# Altium schematic sheet SDEC944-xD_Liaison_IHM.SchDoc: Liaison IHM
size 393 x 270 mm; CompanyName: Seccom; Address1: 521, rue du capt. François Garbit; Address2: 69440 Mornant; Address3: seccom@seccom.fr; Address4: www.seccom.fr; DocumentNumber: 8; SheetNumber: 8; SheetTotal: 22; PageSetup: Record=PageOptions|CenterHorizontal=True|CenterVertical=True|PrintScale=0.74|XCorrection=1.00|YCorrection=1.00|PrintKind=0|BorderSize=5000000|LeftOffset=0|BottomOffset=0|Orientation=2|PaperLength=1000|PaperWidth=1000|Scale=100|PaperSource=7|PrintQuality=-4|MediaType=1|DitherType=10|PaperKind=A4|PrintScaleMode=1
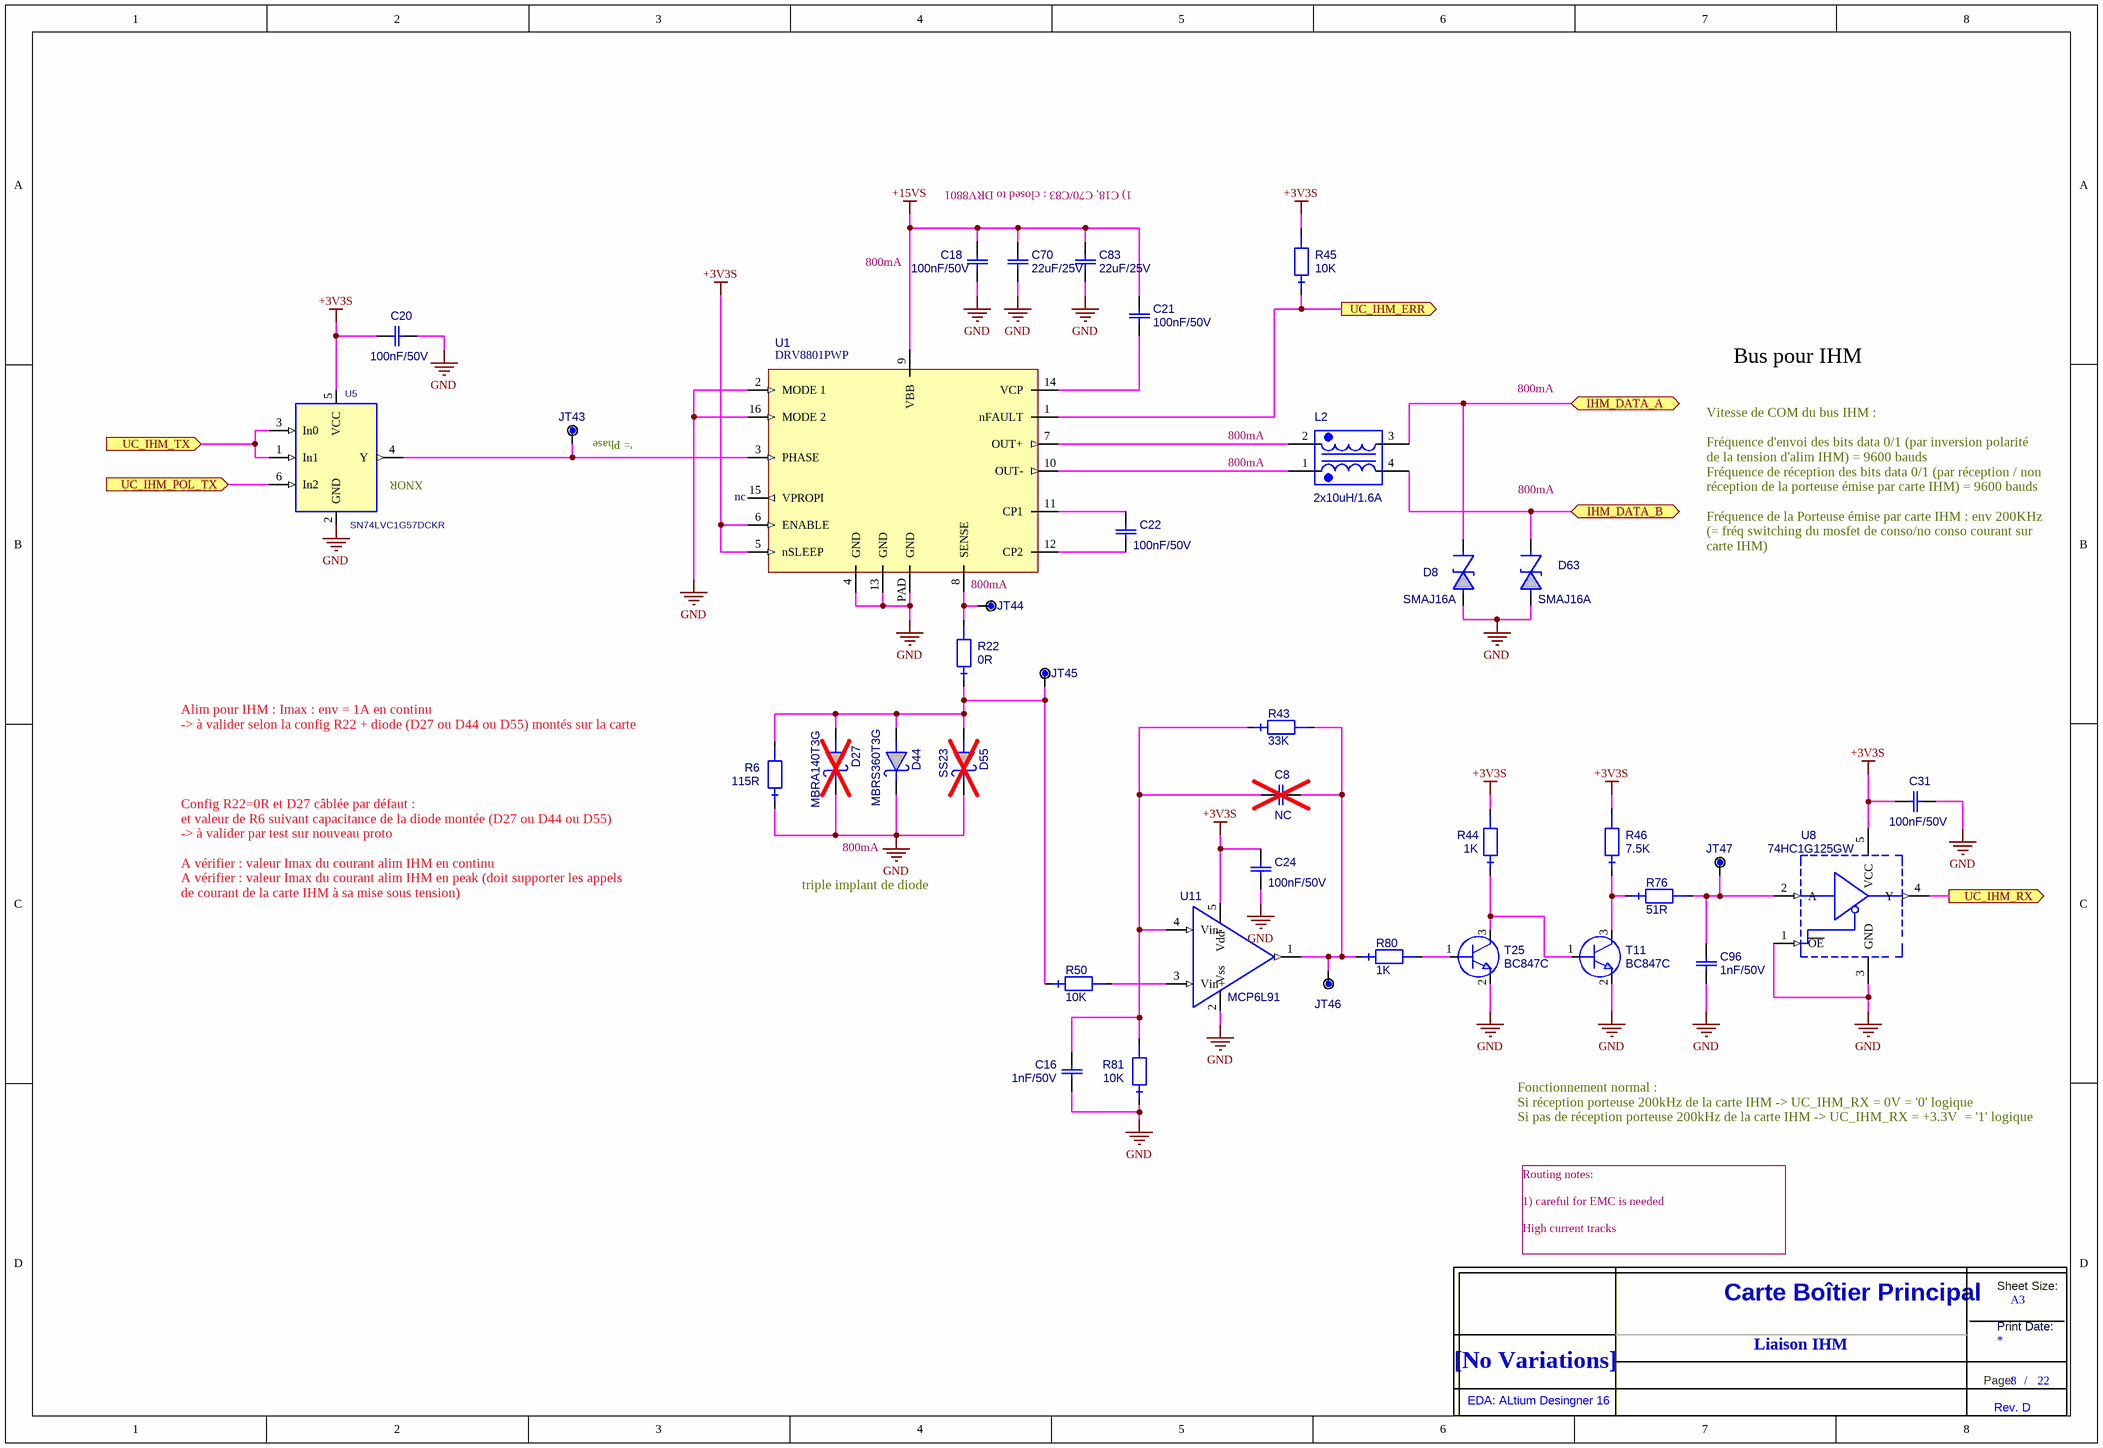
[diagram p0: SDEC944-xD_Liaison_IHM.SchDoc]

## Parts
C8  value NC  [0603_ReflowSoldering_CAP]  (hidden comment: C_0603_NC)  (no BOM)
C16  value 1nF/50V  [0603_ReflowSoldering_CAP]  (hidden comment: C_0603_NPO_5%_1N-50V)
C18  value 100nF/50V  [0603_ReflowSoldering_CAP]  (hidden comment: C_0603_X7R_10%_100N-50V)
C20  value 100nF/50V  [0603_ReflowSoldering_CAP]  (hidden comment: C_0603_X7R_10%_100N-50V)
C21  value 100nF/50V  [0603_ReflowSoldering_CAP]  (hidden comment: C_0603_X7R_10%_100N-50V)
C22  value 100nF/50V  [0603_ReflowSoldering_CAP]  (hidden comment: C_0603_X7R_10%_100N-50V)
C24  value 100nF/50V  [0603_ReflowSoldering_CAP]  (hidden comment: C_0603_X7R_10%_100N-50V)
C31  value 100nF/50V  [0603_ReflowSoldering_CAP]  (hidden comment: C_0603_X7R_10%_100N-50V)
C70  value 22uF/25V  [1206_ReflowSoldering_CAP]  (hidden comment: C_1206_X5R_20%_22U-25V)
C83  value 22uF/25V  [1206_ReflowSoldering_CAP]  (hidden comment: C_1206_X5R_20%_22U-25V)
C96  value 1nF/50V  [0603_ReflowSoldering_CAP]  (hidden comment: C_0603_NPO_5%_1N-50V)
D8  SMAJ16A  [DO214AC-SMA-P_ReflowSoldering]
D27  MBRA140T3G  [DO214AC-SMA-P_ReflowSoldering]  (no BOM)
D44  MBRS360T3G  [DO214AB-SMC-P_ReflowSoldering]
D55  SS23  [DO214AA-SMB-P_ReflowSoldering]  (no BOM)
D63  SMAJ16A  [DO214AC-SMA-P_ReflowSoldering]
JT43  POINT_TEST_PAD_40MIL  [PAD_CL5_E40X40Y17D]  (value not drawn)  (no BOM)
JT44  POINT_TEST_PAD_40MIL  [PAD_CL5_E40X40Y17D]  (value not drawn)  (no BOM)
JT45  POINT_TEST_PAD_40MIL  [PAD_CL5_E40X40Y17D]  (value not drawn)  (no BOM)
JT46  POINT_TEST_PAD_40MIL  [PAD_CL5_E40X40Y17D]  (value not drawn)  (no BOM)
JT47  POINT_TEST_PAD_40MIL  [PAD_CL5_E40X40Y17D]  (value not drawn)  (no BOM)
L2  value 2x10uH/1.6A  [SELF_WE-SL2_9.2x6]  (hidden comment: IND_FERRITE_WE-SL2_2X10UH)
R6  value 115R  [0603_ReflowSoldering_RES]  (hidden comment: RES_0603_1%_100PPM_115R)
R22  value 0R  [0603_ReflowSoldering_RES]  (hidden comment: RES_0603_1%_100PPM_0R)
R43  value 33K  [0603_ReflowSoldering_RES]  (hidden comment: RES_0603_1%_100PPM_33K)
R44  value 1K  [0603_ReflowSoldering_RES]  (hidden comment: RES_0603_1%_100PPM_1K)
R45  value 10K  [0603_ReflowSoldering_RES]  (hidden comment: RES_0603_1%_100PPM_10K)
R46  value 7.5K  [0603_ReflowSoldering_RES]  (hidden comment: RES_0603_1%_100PPM_7.5K)
R50  value 10K  [0603_ReflowSoldering_RES]  (hidden comment: RES_0603_1%_100PPM_10K)
R76  value 51R  [0603_ReflowSoldering_RES]  (hidden comment: RES_0603_1%_100PPM_51R)
R80  value 1K  [0603_ReflowSoldering_RES]  (hidden comment: RES_0603_1%_100PPM_1K)
R81  value 10K  [0603_ReflowSoldering_RES]  (hidden comment: RES_0603_1%_100PPM_10K)
T11  BC847C  [SOT23_3L_ReflowSoldering]
T25  BC847C  [SOT23_3L_ReflowSoldering]
Title_new  DNI  (value not drawn)  (graphical)
U1  DRV8801PWP  [HTSSOP_016_E0,65_L4,4MM_PWP]
U5  value SN74LVC1G57DCKR  [SC70_6]  (hidden comment: 74LVC1G57DCKR)
U8  74HC1G125GW  [SOT353]
U11  value MCP6L91  [SOT23_5L]  (hidden comment: MCP6L91T-E/OT)

## Ports
IHM_DATA_A (bidir), IHM_DATA_B (bidir), UC_IHM_ERR (out), UC_IHM_POL_TX (in), UC_IHM_RX (out), UC_IHM_TX (in)

## Nets
+3V3S: C20.1 C24.1 C31.1 R44.2 R45.2 R46.2 U1.5(nSLEEP) U1.6(ENABLE) U5.5(VCC) U8.5(VCC) U11.5(Vdd)
+15VS: C18.1 C21.1 C70.2 C83.2 U1.9(VBB)
GND: C16.1 C18.2 C20.2 C24.2 C31.2 C70.1 C83.1 C96.1 D8.A D27.K D44.K D55.K D63.A R6.1 R81.1 T11.2(E) T25.2(E) U1.2(MODE_1) U1.4(GND) U1.13(GND) U1.16(MODE_2) U1.PAD(GND) U5.2(GND) U8.1 U8.3(GND) U11.2(Vss)
IHM_DATA_A: D8.K L2.3 ; port IHM_DATA_A
IHM_DATA_B: D63.K L2.4 ; port IHM_DATA_B
UC_IHM_ERR: R45.1 U1.1(nFAULT) ; port UC_IHM_ERR
UC_IHM_POL_TX: U5.6(In2) ; port UC_IHM_POL_TX
UC_IHM_RX: U8.4(Y) ; port UC_IHM_RX
UC_IHM_TX: U5.1(In1) U5.3(In0) ; port UC_IHM_TX
NetC8_1: C8.1 JT46.1 R43.2 R80.1 U11.1(OUTPUT)
NetC8_2: C8.2 C16.2 R43.1 R81.2 U11.4(Vin-)
NetC21_2: C21.2 U1.14(VCP)
NetC22_1: C22.1 U1.11(CP1)
NetC22_2: C22.2 U1.12(CP2)
NetC96_2: C96.2 JT47.1 R76.2 U8.2(A)
NetD27_A: D27.A D44.A D55.A JT45.1 R6.2 R22.1 R50.1
NetJT43_1: JT43.1 U1.3(PHASE) U5.4(Y)
NetJT44_1: JT44.1 R22.2 U1.8(SENSE)
NetL2_1: L2.1 U1.10(OUT-)
NetL2_2: L2.2 U1.7(OUT+)
NetR44_1: R44.1 T11.1(B) T25.3(C)
NetR46_1: R46.1 R76.1 T11.3(C)
NetR50_2: R50.2 U11.3(Vin+)
NetR80_2: R80.2 T25.1(B)

Not connected (* = marked no-connect by the designer): U1 15(VPROPI)

## Notes on the sheet
- 1) C18, C70/C83 : closed to DRV8801
- 800mA
- Bus pour IHM
- (near JT43) '= Phase
- (near U5) XNOR
- (near U1) nc
- Vitesse de COM du bus IHM :
  Fréquence d'envoi des bits data 0/1 (par inversion polarité de la tension d'alim IHM) = 9600 bauds
  Fréquence de réception des bits data 0/1 (par réception / non réception de la porteuse émise par carte IHM) = 9600 bauds
  Fréquence de la Porteuse émise par carte IHM : env 200KHz (= fréq switching du mosfet de conso/no conso courant sur carte IHM)
- Alim pour IHM : Imax : env = 1A en continu
  -> à valider selon la config R22 + diode (D27 ou D44 ou D55) montés sur la carte
- Config R22=0R et D27 câblée par défaut :
  et valeur de R6 suivant capacitance de la diode montée (D27 ou D44 ou D55)
  -> à valider par test sur nouveau proto
  A vérifier : valeur Imax du courant alim IHM en continu
  A vérifier : valeur Imax du courant alim IHM en peak (doit supporter les appels de courant de la carte IHM à sa mise sous tension)
- triple implant de diode
- Fonctionnement normal :
  Si réception porteuse 200kHz de la carte IHM -> UC_IHM_RX = 0V = '0' logique
  Si pas de réception porteuse 200kHz de la carte IHM -> UC_IHM_RX = +3.3V  = '1' logique
- Routing notes:
  1) careful for EMC is needed
  High current tracks
- Liaison IHM
- (in symbol Title_new) Sheet Size:; Carte Boîtier Principal; A3; Print Date:; [No Variations]; Page:; /; EDA: ALtium Desingner 16; Rev. D

## Library data of the parts
C8 = C_0603_NC: Condensateur, CMS 0603, NC; Creation: PDP (30/08/12); Boitier: 0603; Coeff: 1; ComponentLink2URL: o:\_Documentation\Datasheets\_BOITIERS\PASSIF_CMS\; ComponentLink2Description: Datasheet Boitier
C16 C96 = C_0603_NPO_5%_1N-50V: Condensateur céramique, NPO, 5%, CMS 0603; Creation: LJ; Reference: 001809/00; Boitier: 0603; Remarque: {Remarque}; Coeff: 1; Fabricant: AVX; Ref Fab: 06035A102JAT2A; ComponentLink1URL: o:\_Documentation\Datasheets\BC_Components\Condo_CMS_NPO-X7R-Y5V.pdf; ComponentLink2URL: o:\_Documentation\Datasheets\_BOITIERS\PASSIF_CMS\; Config: *; ComponentLink1Description: Datasheet; ComponentLink2Description: Datasheet Boitier; Supplier 1: Mouser; Supplier Part Number 1: 581-06035A102J
C18 C20-C22 C24 C31 = C_0603_X7R_10%_100N-50V: Condensateur céramique, X7R, 10%, CMS 0603, 100nF/50V; Creation: FB (29/02/12); Boitier: 0603; Remarque: {Remarque}; Fabricant: Kemet; Ref Fab: C0603C104K5RAC; Coeff: 1; ComponentLink1URL: O:\_Documentation\Datasheets\Kemet\Condos_Ceramic_CMS.pdf; ComponentLink2URL: o:\_Documentation\Datasheets\_BOITIERS\PASSIF_CMS\; Config: *; ComponentLink1Description: Datasheet; ComponentLink2Description: Datasheet Boitier; Supplier 1: Farnell; Supplier Part Number 1: 1288255
C70 C83 = C_1206_X5R_20%_22U-25V: Condensateur céramique, X5R, 20%, CMS 1206, 22uF/25V; Creation: ZA (18/12/13); Reference: /01; Boitier: 1206; Remarque: {Remarque}; Fabricant: TDK; Coeff: 1; Ref Fab: C3216X5R1E226M160AB; Verification: *; ComponentLink1URL: O:\_Documentation\Datasheets\TDK\general_B11.pdf; ComponentLink2URL: o:\_Documentation\Datasheets\_BOITIERS\PASSIF_CMS\; ComponentLink1Description: Datasheet; ComponentLink2Description: Datasheet Boitier; Supplier 1: Farnell; Supplier Part Number 1: 2354129; Supplier 2: Mouser; Supplier Part Number 2: 810-C3216X5R1E226M
D8 D63 = SMAJ16A: Diode Transil/TVS unidirectionnelle (A), Transzorb, 400W, 16V, CMS; Creation: ZA (29/07/13); Boitier: DO214AC/SMA; Remarque: {Remarque}; Coeff: 1; Fabricant: Bourns; ComponentLink1URL: o:\_Documentation\Datasheets\Bourns\SMAJ-74970.pdf; ComponentLink2URL: o:\_Documentation\Datasheets\_BOITIERS\ACTIF_CMS\SMx\SMB_(Schneider).lnk; Config: *; ComponentLink1Description: Datasheet; ComponentLink2Description: Datasheet Boitier; Ref Fab: SMAJ16A; Supplier 1: Farnell; Supplier Part Number 1: 1843352; Supplier 2: Mouser; Supplier Part Number 2: 652-SMAJ16A; Value: SMAJ16A
D27 = MBRA140T3G: Diode Schottky, Vrrm=40V, If=1A, Vf=0.55V@1A, CMS; Creation: PDP (31/08/12); Boitier: DO214AC/SMA; Fabricant: ON Semiconductor; Coeff: 1; Ref Fab: MBRA140T3G; ComponentLink1URL: O:\_Documentation\Datasheets\ON_Semiconductors\MBRA140T3-D.PDF; ComponentLink2URL: O:\_Documentation\Datasheets\ON_Semiconductors\MBRA140T3-D.PDF; Config: *; ComponentLink1Description: Datasheet; ComponentLink2Description: Datasheet Boitier; Supplier 1: Farnell; Supplier Part Number 1: 9555986; Supplier 2: Mouser; Supplier Part Number 2: 863-MBRA140T3G; Value: MBRA140T3G
D44 = MBRS360T3G: Diode Schottky, Vrrm=60V, If=3A, Vf=0.74V, -65 à +175°C, CMS; Creation: ZA (16/04/13); Boitier: DO214AB/SMC; Fabricant: ON Semiconductor; Coeff: 1; Ref Fab: MBRS360T3G; ComponentLink1URL: O:\_Documentation\Datasheets\ON_Semiconductors\MBRS360T3G_NRVBS360T3G.PDF; ComponentLink2URL: O:\_Documentation\Datasheets\ON_Semiconductors\MBRS360T3G_NRVBS360T3G.PDF; Config: *; ComponentLink1Description: Datasheet; ComponentLink2Description: Datasheet Boitier; Supplier 1: Farnell; Supplier Part Number 1: 9556940; Supplier 2: Mouser; Supplier Part Number 2: 863-MBRS360T3G; Value: MBRS360T3G
D55 = SS23: Diode Schottky, Vrrm=30V, If=2A, Vf=0.5V, -65 à +125°C, CMS; Creation: ZA (16/04/13); Boitier: DO214AA/SMB; Fabricant: Fairchild; Coeff: 1; Verification: *; Ref Fab: SS23; ComponentLink1URL: o:\_Documentation\Datasheets\Fairchild\SS22-S210.pdf; ComponentLink2URL: o:\_Documentation\Datasheets\Fairchild\SS22-S210.pdf; Config: *; ComponentLink1Description: Datasheet; ComponentLink2Description: Datasheet Boitier; Supplier 1: Farnell; Supplier Part Number 1: 9843795; Supplier 2: Mouser; Supplier Part Number 2: 512-SS23; Value: SS23
JT43-JT47 = POINT_TEST_PAD_40MIL: Point de test sur CI, pad de diamètre 1.016mm (40mils); Creation: FB (04/10/12); Remarque: {Remarque}; Coeff: 1; Value: POINT_TEST; Config: *; ComponentLink1Description: Datasheet; ComponentLink2Description: Datasheet Boitier
L2 = IND_FERRITE_WE-SL2_2X10UH: Filtre double ferrite, 2x10uH, 42Vac/80Vdc, 1.6A, serie WE-SL2, -40/+125°C, CMS; Creation: FB (19/03/12); Boitier: WE-SL2_9.2x6_h5mm; Coeff: 1; Fabricant: Wurth Elektronik; Ref Fab: 744226; ComponentLink1URL: O:\_Documentation\Datasheets\Wurth_Elektronik\744226.pdf; ComponentLink2URL: o:\_Documentation\Datasheets\_BOITIERS\; Config: *; ComponentLink1Description: Datasheet; ComponentLink2Description: Datasheet Boitier; Supplier Part Number 1: 1636269; Supplier 1: Farnell; Supplier 2: Radiospares; Supplier Part Number 2: 3675045
R6 = RES_0603_1%_100PPM_115R: Résistance, 0.100W, 1%, 100ppm, 75V, 115R; Creation: PDP (03/10/12); Boitier: 0603; Remarque: {Remarque}; Fabricant: Vishay; Ref Fab: CRCW0603115RFKEA; Coeff: 1; Verification: *; ComponentLink1URL: O:\_Documentation\Datasheets\Vishay\Resistances_D-CRCWe3.pdf; ComponentLink2URL: o:\_Documentation\Datasheets\_BOITIERS\PASSIF_CMS\; Config: *; ComponentLink1Description: Datasheet; ComponentLink2Description: Datasheet Boitier; Supplier 1: Mouser; Supplier Part Number 1: 71-CRCW0603-115-E3; Supplier 2: Farnell; Supplier Part Number 2: 2141284
R22 = RES_0603_1%_100PPM_0R: Résistance, 0.100W, 1%, 100ppm, 75V, 0R; Creation: FB (04/07/12); Boitier: 0603; Fabricant: Vishay; Ref Fab: CRCW06030000Z0EA; Coeff: 1; Remarque: {Remarque}; Verification: *; ComponentLink1URL: O:\_Documentation\Datasheets\Vishay\Resistances_D-CRCWe3.pdf; ComponentLink2URL: o:\_Documentation\Datasheets\_BOITIERS\PASSIF_CMS\; Config: *; ComponentLink1Description: Datasheet; ComponentLink2Description: Datasheet Boitier; Supplier 1: Farnell; Supplier Part Number 1: 1469739
R43 = RES_0603_1%_100PPM_33K: Résistance, 0.100W, 1%, 100ppm, 75V, 33K; Creation: JPL (05/07/12); Boitier: 0603; Remarque: {Remarque}; Coeff: 1; Fabricant: Vishay; Ref Fab: CRCW060333K0FKEA; Verification: *; ComponentLink1URL: O:\_Documentation\Datasheets\Vishay\Resistances_D-CRCWe3.pdf; ComponentLink2URL: o:\_Documentation\Datasheets\_BOITIERS\PASSIF_CMS\; Config: *; ComponentLink1Description: Datasheet; ComponentLink2Description: Datasheet Boitier; Supplier 1: Farnell; Supplier Part Number 1: 1469801; Supplier 2: RadioSpares; Supplier Part Number 2: 6790232
R44 R80 = RES_0603_1%_100PPM_1K: Résistance, 0.100W, 1%, 100ppm, 75V, 1K; Creation: JPL (05/07/12); Boitier: 0603; Remarque: {Remarque}; Fabricant: Vishay; Ref Fab: CRCW06031K00FKEA; Coeff: 1; Verification: *; ComponentLink1URL: O:\_Documentation\Datasheets\Vishay\Resistances_D-CRCWe3.pdf; ComponentLink2URL: o:\_Documentation\Datasheets\_BOITIERS\PASSIF_CMS\; Config: *; ComponentLink1Description: Datasheet; ComponentLink2Description: Datasheet Boitier; Supplier 1: Farnell; Supplier 2: RadioSpares; Supplier Part Number 1: 1469740; Supplier Part Number 2: 6789875
R45 = RES_0603_1%_100PPM_10K: Résistance, 0.100W, 1%, 100ppm, 75V, 10K; Creation: JPL (05/07/12); Boitier: 0603; Remarque: {Remarque}; Fabricant: Vishay; Ref Fab: CRCW060310K0FKEA; Coeff: 1; Verification: *; ComponentLink1URL: O:\_Documentation\Datasheets\Vishay\Resistances_D-CRCWe3.pdf; ComponentLink2URL: o:\_Documentation\Datasheets\_BOITIERS\PASSIF_CMS\; Config: *; ComponentLink1Description: Datasheet; ComponentLink2Description: Datasheet Boitier; Supplier 1: Farnell; Supplier 2: RadioSpares; Supplier Part Number 1: 1469748; Supplier Part Number 2: 6789667
R46 = RES_0603_1%_100PPM_7.5K: Résistance, 0.100W, 1%, 100ppm, 75V, 7.5K; Creation: ZA (12/04/13); Boitier: 0603; Remarque: {Remarque}; Fabricant: Vishay; Ref Fab: CRCW06037K50FKEA; Coeff: 1; Verification: *; ComponentLink1URL: o:\_Documentation\Datasheets\Vishay\Resistances_D-CRCWe3.pdf; ComponentLink2URL: o:\_Documentation\Datasheets\_BOITIERS\PASSIF_CMS\; Config: *; ComponentLink1Description: Datasheet; ComponentLink2Description: Datasheet Boitier; Supplier 1: Farnell; Supplier 2: Mouser; Supplier Part Number 1: 1469835; Supplier Part Number 2: 71-CRCW0603-7.5K-E3
R50 R81 = RES_0603_1%_100PPM_10K: Résistance, 0.100W, 1%, 100ppm, 75V, 10K; Creation: JPL (05/07/12); Boitier: 0603; Remarque: {Remarque}; Coeff: 1; Fabricant: Vishay; Ref Fab: CRCW060310K0FKEA; Verification: *; ComponentLink1URL: O:\_Documentation\Datasheets\Vishay\Resistances_D-CRCWe3.pdf; ComponentLink2URL: o:\_Documentation\Datasheets\_BOITIERS\PASSIF_CMS\; Config: *; ComponentLink1Description: Datasheet; ComponentLink2Description: Datasheet Boitier; Supplier 1: Farnell; Supplier Part Number 1: 1469748; Supplier 2: RadioSpares; Supplier Part Number 2: 6789667
R76 = RES_0603_1%_100PPM_51R: Résistance, 0.100W, 1%, 100ppm, 75V, 51R; Creation: JPL (05/07/12); Boitier: 0603; Remarque: {Remarque}; Fabricant: Vishay; Ref Fab: CRCW060351R0FKEA; Coeff: 1; Verification: *; ComponentLink1URL: O:\_Documentation\Datasheets\Vishay\Resistances_D-CRCWe3.pdf; ComponentLink2URL: o:\_Documentation\Datasheets\_BOITIERS\PASSIF_CMS\; Config: *; ComponentLink1Description: Datasheet; ComponentLink2Description: Datasheet Boitier; Supplier 1: Farnell; Supplier 2: Mouser; Supplier Part Number 1: 1652889; Supplier Part Number 2: 71-CRCW0603-51-E3
T11 T25 = BC847C: Transistor NPN, Vce=50V, Ic=0.1A, hfe=420~800, 0.25W, CMS; Creation: GO (08/07/05); Verification: LJ (21/07/05); Reference: 000329/00; Boitier: SOT23_3L; Remarque: Complementaires aux BC856-860; Fabricant: NXP; Coeff: 1; Ref Fab: BC847C; ComponentLink1URL: O:\_Documentation\Datasheets\NXP\BC847.pdf; ComponentLink2URL: o:\_Documentation\Datasheets\_BOITIERS\ACTIF_CMS\SOT\SOT_23_3P_(Schneider).PDF; Config: *; ComponentLink1Description: Datasheet; Value: BC847C; Supplier 1: Farnell; Supplier Part Number 1: 1081235; ComponentLink2Description: Datasheet Boitier
Title_new = Title_new
U1 = DRV8801PWP: Brushed DC Motor Driver with Current Sense, 2.8A, CMS; Creation: PDP (31/08/12); Boitier: HTSSOP16_PowerPAD (R-PDSO-G16); Remarque: {Remarque}; Fabricant: Texas Instruments; Coeff: 1; Ref Fab: DRV8801PWP; ComponentLink1URL: O:\_Documentation\Datasheets\Texas\drv8801.pdf; ComponentLink2URL: O:\_Documentation\Datasheets\Texas\drv8801.pdf; Config: *; ComponentLink1Description: Datasheet; ComponentLink2Description: Datasheet Boitier; Value: DRV8801PWP; Supplier 1: Mouser; Supplier Part Number 1: 595-DRV8801PWP; Supplier 2: Farnell; Supplier Part Number 2: 1754826
U5 = 74LVC1G57DCKR: Porte logique multifonction, AND/OR/NAND/NOR/XNOR/INV/BUFFER, LVC, CMS SC70_6; Creation: PDP (31/08/2012); Remarque: {Remarque}; Coeff: 1; Fabricant: Texas Instruments; Verification: *; Boitier: SC70_6; ComponentLink1URL: o:\_Documentation\Datasheets\Texas\SN74LVC1G57.pdf; ComponentLink2URL: o:\_Documentation\Datasheets\_Boitiers\ACTIF_CMS\SC\SC70_6_e0,65_(NSC).pdf; Config: *; ComponentLink1Description: Datasheet; ComponentLink2Description: Datasheet Boitier; Ref Fab: SN74LVC1G57DCKR; Supplier 1: Farnell; Supplier Part Number 1: 1470833; Supplier 2: Mouser; Supplier Part Number 2: 595-SN74LVC1G57DCKR
U8 = 74HC1G125GW: Buffer driver de ligne non-inverseur simple, 3 états, CMOS, Picogate, CMS; Creation: PDP (28/09/12); Remarque: {Remarque}; Coeff: 1; Fabricant: NXP; Verification: *; Boitier: SOT353; ComponentLink1URL: o:\_Documentation\Datasheets\NXP\74HC_HCT1G125.pdf; ComponentLink2URL: o:\_Documentation\Datasheets\_Boitiers\ACTIF_CMS\SOT & TSOT\SOT353_5_reflow_(NXP).pdf; Config: *; ComponentLink1Description: Datasheet; ComponentLink2Description: Datasheet Boitier; Ref Fab: 74HC1G125GW; Supplier 1: Mouser; Supplier Part Number 1: 771-74HC1G125GW-G; Supplier 2: Farnell; Supplier Part Number 2: 1867065; Value: 74HC1G125GW
U11 = MCP6L91T-E/OT: Comparateur de tension, simple, Vs=+1.8~5.5V, CMOS, I/O Rail-to-Rail, CMS; Creation: PDP (03/09/2012); Remarque: {Remarque}; Coeff: 1; Fabricant: Microchip; Boitier: SOT23_5L; ComponentLink1URL: O:\_Documentation\Datasheets\MicroChip\MCP6L91R.pdf; ComponentLink2URL: o:\_Documentation\Datasheets\_BOITIERS\ACTIF_CMS\SOT\SOT_23_5P_(Schneider).pdf; Config: *; ComponentLink1Description: Datasheet; ComponentLink2Description: Datasheet Boitier; Ref Fab: MCP6L91T-E/OT; Supplier 1: Mouser; Supplier Part Number 1: 579-MCP6L91T-E/OT; Supplier 2: Farnell; Supplier Part Number 2: 1715865